# EasyEDA schematic SCH_X2FA_2025-07-30.json
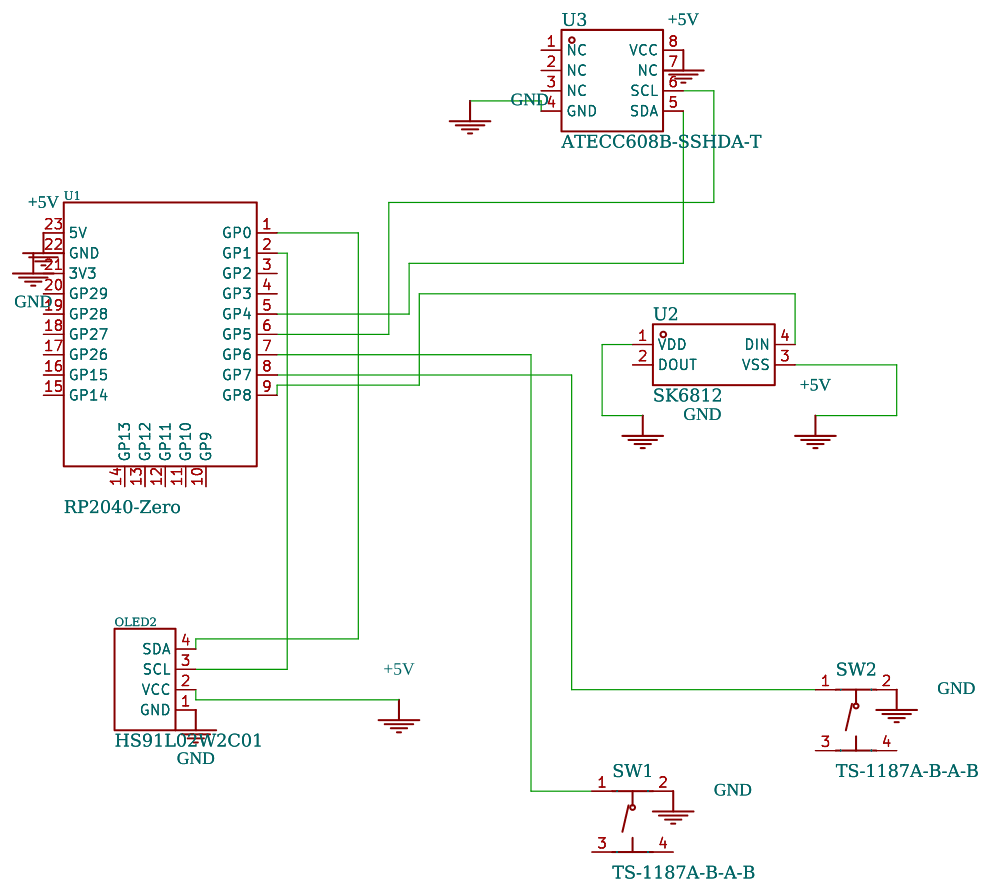
[diagram p0: schematic sheet]

## Parts
OLED2  HS91L02W2C01  [OLED-TH_L38.0-W12.0_HS91L02W2C01]
SW1  TS-1187A-B-A-B  [SW-SMD_4P-L5.1-W5.1-P3.70-LS6.5-TL_H1.5]
SW2  TS-1187A-B-A-B  [SW-SMD_4P-L5.1-W5.1-P3.70-LS6.5-TL_H1.5]
U1  RP2040-Zero  [COMM-SMD_RP2040-ZERO]
U2  SK6812  [LED-SMD_4P-L5.0-W5.0-TL]
U3  ATECC608B-SSHDA-T  [SOIC-8_L4.9-W3.9-P1.27-LS6.0-BL]

## Library data of the parts
OLED2 = -: Supplier: LCSC; Supplier Part: C5248081; Manufacturer: HS(汉昇); JLCPCB Part Class: Extended Part; LCSC Part Name: 0.91寸OLED显示屏白光IIC; Datasheet: https://atta.szlcsc.com/upload/public/pdf/source/20230727/C3E43C8E3DDA847F5681FEE7D95C153D.pdf; Add into BOM: yes; Convert to PCB: yes; Main Control Chip: SSD1306; Interface Type: I2C; Size: 0.91; Pixel Resolution: 128x32; Operating Temperature: -40℃+70℃
SW1 SW2 = -: LCSC Part Name: 5.1*5.1*1.5mm 立贴 轻触开关; Supplier Part: C318884; Manufacturer: XKB Connectivity(中国星坤); Supplier Footprint: SMD; JLCPCB Part Class: Basic Part; Datasheet: https://atta.szlcsc.com/upload/public/pdf/source/20200227/C318890_053E50208A88A7BA1965D8746000774E.pdf; Supplier: LCSC; Add into BOM: yes; Convert to PCB: yes; Circuit: SPST; Actuator Style: Round Button; Operating Force: 160gf; Mounting Style: Brick nogging; Switch Length: 5.1mm; Switch Width: 5.1mm; Switch Height: 1.5mm; Strike Gundam: 不带; Contact Current: 50mA; Voltage Rating (DC): 12V; Actuator/Cap Color: 金色; With Lamp: No; Mechanical Life: 10万次; Operating Temperature: -30℃+85℃
U1 = -: Symbol: RP2040-ZERO; Supplier: LCSC; Supplier Part: C5350143; Manufacturer: Waveshare(微雪电子); JLCPCB Part Class: Extended Part; LCSC Part Name: 微雪 树莓派RP2040-Zero微控制器 PICO开发板 RP2040双核处理器; Supplier Footprint: LCC-22(18x23.5); Datasheet: https://atta.szlcsc.com/upload/public/pdf/source/20230328/F7ADB41143C3623278858A7E8047DBCD.pdf; Add into BOM: yes; Convert to PCB: yes
U2 = -: Supplier Part: C2765348; Supplier Footprint: SMD-4P,2.0x4; Supplier: LCSC; Add into BOM: yes; Convert to PCB: yes
U3 = -: LCSC Part Name: ATECC608B 微芯科技 加密认证芯片; Supplier Part: C1518769; Manufacturer: MICROCHIP(美国微芯); Supplier Footprint: SOIC-8; Datasheet: https://atta.szlcsc.com/upload/public/pdf/source/20210610/C1518769_D4947FAF96BEA4E6060FDFEE17E83E17.pdf; Supplier: LCSC; Add into BOM: yes; Convert to PCB: yes; Algorithm: ECDH；ECDSA；AES-128；SHA-256；HMAC; Interface: 1-Wire；I2C; Standby Current (Max): 150nA; Supply Voltage: 2V5.5V; Operating Temperature: -40℃+85℃

## Nets
+5V: OLED2.2(VCC) U1.23(5V) U2.3(VSS) U3.8(VCC)
GND: OLED2.1(GND) SW1.2(B) SW2.2(B) U2.1(VDD) U3.4(GND)
Net-(OLED2-3): OLED2.3(SCL) U1.2(GP1)
Net-(OLED2-4): OLED2.4(SDA) U1.1(GP0)
Net-(SW1-1): SW1.1(A) U1.7(GP6)
Net-(SW2-1): SW2.1(A) U1.8(GP7)
Net-(U1-5): U1.5(GP4) U3.5(SDA)
Net-(U1-6): U1.6(GP5) U3.6(SCL)
Net-(U1-9): U1.9(GP8) U2.4(DIN)

Not connected (* = marked no-connect by the designer): SW1 3(C) 4(D); SW2 3(C) 4(D); U1 3(GP2) 4(GP3) 10(GP9) 11(GP10) 12(GP11) 13(GP12) 14(GP13) 15(GP14) 16(GP15) 17(GP26) 18(GP27) 19(GP28) 20(GP29) 21(3V3) 22(GND); U2 2(DOUT); U3 1(NC) 2(NC) 3(NC) 7(NC)
